# Altium schematic sheet LCD CONNECTORS.schdoc
size 82 x 73 mm
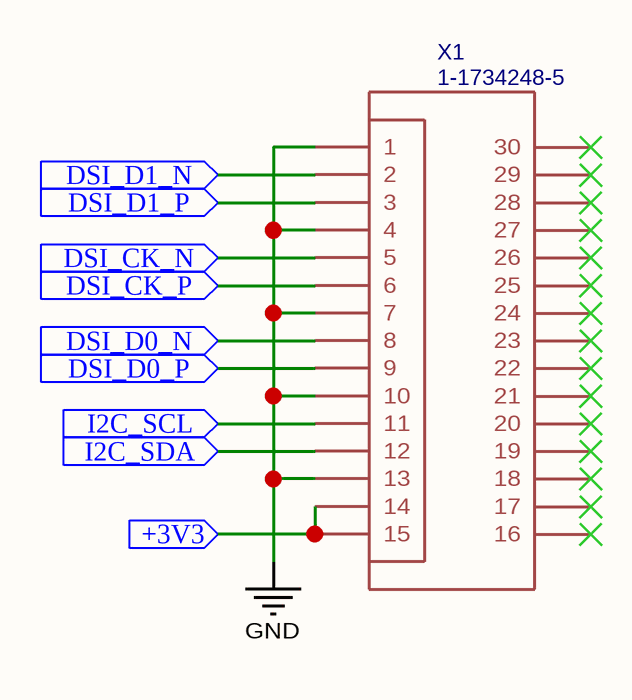
[diagram p0: LCD CONNECTORS.schdoc]

## Parts
X1  1-1734248-5  [1-1734248-5]

## Ports
+3V3 (in), DSI_CK_N (in), DSI_CK_P (in), DSI_D0_N (in), DSI_D0_P (in), DSI_D1_N (in), DSI_D1_P (in), I2C_SCL (in), I2C_SDA (in)

## Nets
GND: X1.1 X1.4 X1.7 X1.10 X1.13
+3V3: X1.14 X1.15 ; port +3V3
DSI_CK_N: X1.5 ; port DSI_CK_N
DSI_CK_P: X1.6 ; port DSI_CK_P
DSI_D0_N: X1.8 ; port DSI_D0_N
DSI_D0_P: X1.9 ; port DSI_D0_P
DSI_D1_N: X1.2 ; port DSI_D1_N
DSI_D1_P: X1.3 ; port DSI_D1_P
I2C_SCL: X1.11 ; port I2C_SCL
I2C_SDA: X1.12 ; port I2C_SDA

Not connected (* = marked no-connect by the designer): X1 16* 17* 18* 19* 20* 21* 22* 23* 24* 25* 26* 27* 28* 29* 30*

## Library data of the parts
X1 = 1-1734248-5: Contributor: IBE_Acc; spicePre: X; spiceSymbolName: 1-1734248-5